# Altium schematic sheet K8-5851E-N1_C134191_2022-10-04.schdoc
size 46 x 29 mm
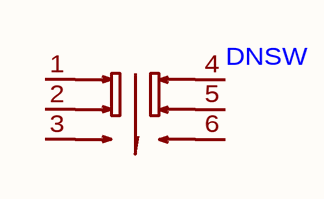
[diagram p0: K8-5851E-N1_C134191_2022-10-04.schdoc]

## Parts
DNSW  (no value)  [SW-TH_6P-L5.8-W5.8-P2.00-LS4.5-BL]

## Nets

Not connected (* = marked no-connect by the designer): DNSW 1 2 3 4 5 6

## Library data of the parts
DNSW = K8-5851E-N1_C134191